# Altium schematic sheet top.SchDoc
size Tabloid; SheetNumber: 1; SheetTotal: 6
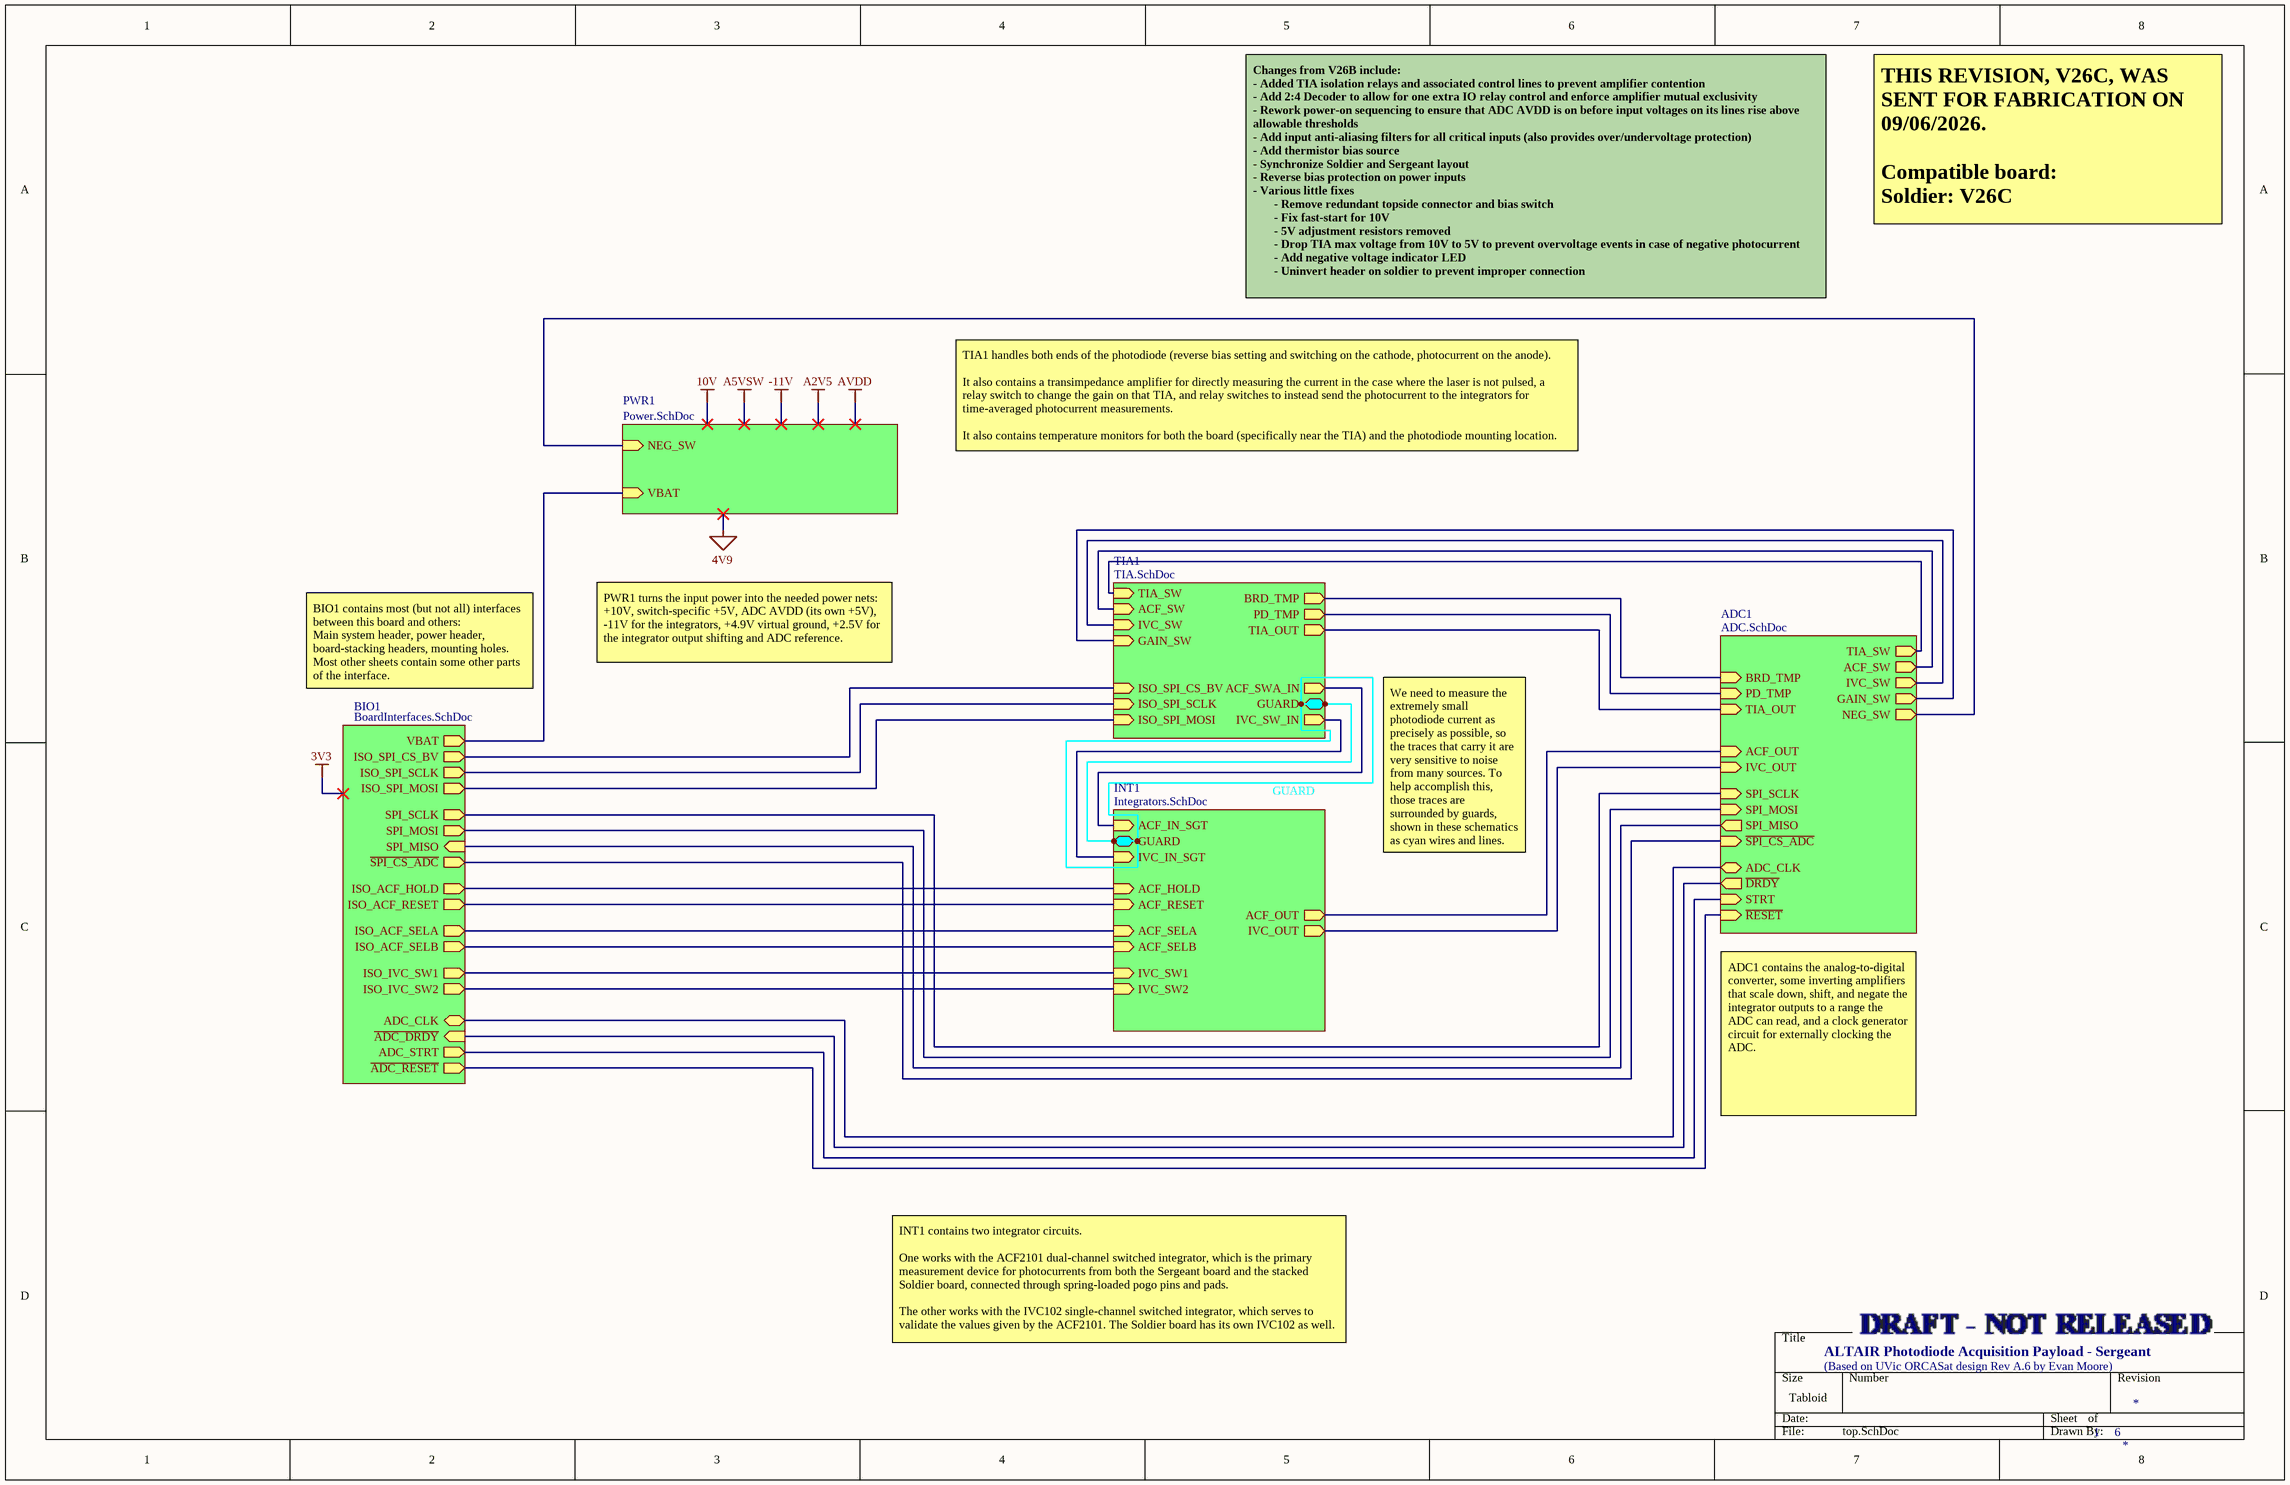
[diagram p0: top.SchDoc]

## Sub-sheets
ADC1 = ADC.SchDoc: PD_TMP (in), BRD_TMP (in), TIA_OUT (in), ~{SPI_CS_ADC} (in), STRT (in), ACF_OUT (in), IVC_OUT (in), SPI_MOSI (in), SPI_SCLK (in), SPI_MISO (out), ~{DRDY} (out), ~{RESET} (in), ADC_CLK (bidir), NEG_SW (out), GAIN_SW (out), IVC_SW (out), ACF_SW (out), TIA_SW (out)
BIO1 = BoardInterfaces.SchDoc: SPI_SCLK (out), SPI_MOSI (out), SPI_MISO (in), ~{SPI_CS_ADC} (out), ADC_CLK (bidir), ~{ADC_DRDY} (in), ADC_STRT (out), ~{ADC_RESET} (out), ISO_ACF_HOLD (out), ISO_ACF_RESET (out), ISO_ACF_SELA (out), ISO_ACF_SELB (out), ISO_IVC_SW1 (out), ISO_IVC_SW2 (out), VBAT (out), ISO_SPI_CS_BV (out), ISO_SPI_SCLK (out), ISO_SPI_MOSI (out)
INT1 = Integrators.SchDoc: ACF_IN_SGT (in), IVC_IN_SGT (in), GUARD (bidir), IVC_SW1 (in), IVC_SW2 (in), IVC_OUT (out), ACF_OUT (out), ACF_HOLD (in), ACF_RESET (in), ACF_SELB (in), ACF_SELA (in)
PWR1 = Power.SchDoc: VBAT (in), NEG_SW (in)
TIA1 = TIA.SchDoc: IVC_SW_IN (out), ACF_SWA_IN (out), TIA_OUT (out), ISO_SPI_SCLK (in), ISO_SPI_MOSI (in), ISO_SPI_CS_BV (in), BRD_TMP (out), PD_TMP (out), GUARD (bidir), GAIN_SW (in), IVC_SW (in), ACF_SW (in), TIA_SW (in)

## Nets
(unnamed): sheet PWR1/VBAT, sheet BIO1/VBAT
(unnamed): sheet PWR1/NEG_SW, sheet ADC1/NEG_SW
(unnamed): sheet BIO1/SPI_SCLK, sheet ADC1/SPI_SCLK
(unnamed): sheet BIO1/SPI_MOSI, sheet ADC1/SPI_MOSI
(unnamed): sheet BIO1/SPI_MISO, sheet ADC1/SPI_MISO
(unnamed): sheet BIO1/~{SPI_CS_ADC}, sheet ADC1/~{SPI_CS_ADC}
(unnamed): sheet BIO1/ADC_CLK, sheet ADC1/ADC_CLK
(unnamed): sheet BIO1/~{ADC_DRDY}, sheet ADC1/~{DRDY}
(unnamed): sheet BIO1/ADC_STRT, sheet ADC1/STRT
(unnamed): sheet BIO1/~{ADC_RESET}, sheet ADC1/~{RESET}
(unnamed): sheet BIO1/ISO_ACF_HOLD, sheet INT1/ACF_HOLD
(unnamed): sheet BIO1/ISO_ACF_RESET, sheet INT1/ACF_RESET
(unnamed): sheet BIO1/ISO_ACF_SELA, sheet INT1/ACF_SELA
(unnamed): sheet BIO1/ISO_ACF_SELB, sheet INT1/ACF_SELB
(unnamed): sheet BIO1/ISO_IVC_SW1, sheet INT1/IVC_SW1
(unnamed): sheet BIO1/ISO_IVC_SW2, sheet INT1/IVC_SW2
(unnamed): sheet BIO1/ISO_SPI_CS_BV, sheet TIA1/ISO_SPI_CS_BV
(unnamed): sheet BIO1/ISO_SPI_SCLK, sheet TIA1/ISO_SPI_SCLK
(unnamed): sheet BIO1/ISO_SPI_MOSI, sheet TIA1/ISO_SPI_MOSI
(unnamed): sheet TIA1/IVC_SW_IN, sheet INT1/IVC_IN_SGT
(unnamed): sheet TIA1/ACF_SWA_IN, sheet INT1/ACF_IN_SGT
(unnamed): sheet TIA1/TIA_OUT, sheet ADC1/TIA_OUT
(unnamed): sheet TIA1/BRD_TMP, sheet ADC1/BRD_TMP
(unnamed): sheet TIA1/PD_TMP, sheet ADC1/PD_TMP
(unnamed): sheet TIA1/GUARD, sheet INT1/GUARD
(unnamed): sheet TIA1/GAIN_SW, sheet ADC1/GAIN_SW
(unnamed): sheet TIA1/IVC_SW, sheet ADC1/IVC_SW
(unnamed): sheet TIA1/ACF_SW, sheet ADC1/ACF_SW
(unnamed): sheet TIA1/TIA_SW, sheet ADC1/TIA_SW
(unnamed): sheet INT1/IVC_OUT, sheet ADC1/IVC_OUT
(unnamed): sheet INT1/ACF_OUT, sheet ADC1/ACF_OUT

## Notes on the sheet
- THIS REVISION, V26C, WAS SENT FOR FABRICATION ON 09/06/2026.
  Compatible board:
  Soldier: V26C
- Changes from V26B include:
  - Added TIA isolation relays and associated control lines to prevent amplifier contention
  - Add 2:4 Decoder to allow for one extra IO relay control and enforce amplifier mutual exclusivity
  - Rework power-on sequencing to ensure that ADC AVDD is on before input voltages on its lines rise above allowable thresholds
  - Add input anti-aliasing filters for all critical inputs (also provides over/undervoltage protection)
  - Add thermistor bias source
  - Synchronize Soldier and Sergeant layout
  - Reverse bias protection on power inputs
  - Various little fixes
  - Remove redundant topside connector and bias switch
  - Fix fast-start for 10V
  - 5V adjustment resistors removed
  - Drop TIA max voltage from 10V to 5V to prevent overvoltage events in case of negative photocurrent
  - Add negative voltage indicator LED
  - Uninvert header on soldier to prevent improper connection
- TIA1 handles both ends of the photodiode (reverse bias setting and switching on the cathode, photocurrent on the anode).
  It also contains a transimpedance amplifier for directly measuring the current in the case where the laser is not pulsed, a relay switch to change the gain on that TIA, and relay switches to instead send the photocurrent to the integrators for time-averaged photocurrent measurements.
  It also contains temperature monitors for both the board (specifically near the TIA) and the photodiode mounting location.
- BIO1 contains most (but not all) interfaces between this board and others:
  Main system header, power header, board-stacking headers, mounting holes.
  Most other sheets contain some other parts of the interface.
- PWR1 turns the input power into the needed power nets:
  +10V, switch-specific +5V, ADC AVDD (its own +5V), -11V for the integrators, +4.9V virtual ground, +2.5V for the integrator output shifting and ADC reference.
- GUARD
- We need to measure the extremely small photodiode current as precisely as possible, so the traces that carry it are very sensitive to noise from many sources. To help accomplish this, those traces are surrounded by guards, shown in these schematics as cyan wires and lines.
- ADC1 contains the analog-to-digital converter, some inverting amplifiers that scale down, shift, and negate the integrator outputs to a range the ADC can read, and a clock generator circuit for externally clocking the ADC.
- INT1 contains two integrator circuits.
  One works with the ACF2101 dual-channel switched integrator, which is the primary measurement device for photocurrents from both the Sergeant board and the stacked Soldier board, connected through spring-loaded pogo pins and pads.
  The other works with the IVC102 single-channel switched integrator, which serves to validate the values given by the ACF2101. The Soldier board has its own IVC102 as well.
- ALTAIR Photodiode Acquisition Payload - Sergeant
- (Based on UVic ORCASat design Rev A.6 by Evan Moore)